# EAGLE design sram (EAGLE 9.6.2)
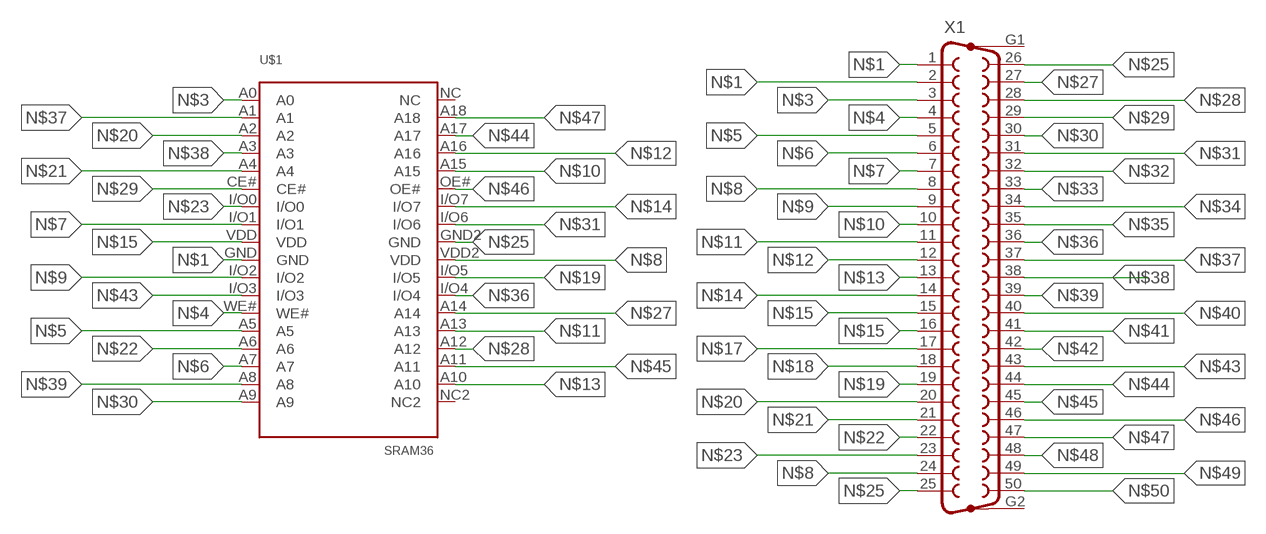
[diagram p0: schematic, sheet 1]

## Parts
U$1  SRAM36  [TF-BGA]
X1  F50VP  [F50VP]

## Nets
N$1: U$1.GND X1.1 X1.2
N$3: U$1.A0 X1.3
N$4: U$1.WE# X1.4
N$5: U$1.A5 X1.5
N$6: U$1.A7 X1.6
N$7: U$1.I/O1 X1.7
N$8: U$1.VDD2(VDD) X1.8 X1.24
N$9: U$1.I/O2 X1.9
N$10: U$1.A15 X1.10
N$11: U$1.A13 X1.11
N$12: U$1.A16 X1.12
N$13: U$1.A10 X1.13
N$14: U$1.I/O7 X1.14
N$15: U$1.VDD X1.15 X1.16
N$17: X1.17
N$18: X1.18
N$19: U$1.I/O5 X1.19
N$20: U$1.A2 X1.20
N$21: U$1.A4 X1.21
N$22: U$1.A6 X1.22
N$23: U$1.I/O0 X1.23
N$25: U$1.GND2(GND) X1.25 X1.26
N$27: U$1.A14 X1.27
N$28: U$1.A12 X1.28
N$29: U$1.CE# X1.29
N$30: U$1.A9 X1.30
N$31: U$1.I/O6 X1.31
N$32: X1.32
N$33: X1.33
N$34: X1.34
N$35: X1.35
N$36: U$1.I/O4 X1.36
N$37: U$1.A1 X1.37
N$38: U$1.A3 X1.38
N$39: U$1.A8 X1.39
N$40: X1.40
N$41: X1.41
N$42: X1.42
N$43: U$1.I/O3 X1.43
N$44: U$1.A17 X1.44
N$45: U$1.A11 X1.45
N$46: U$1.OE# X1.46
N$47: U$1.A18 X1.47
N$48: X1.48
N$49: X1.49
N$50: X1.50
Unconnected: U$1.NC U$1.NC2 X1.G1 X1.G2

## Library data of the parts
U$1 = SRAM:SRAM36
X1 = con-subd:F50VP: SUB-D; OC_FARNELL: unknown; OC_NEWARK: unknown

## Board
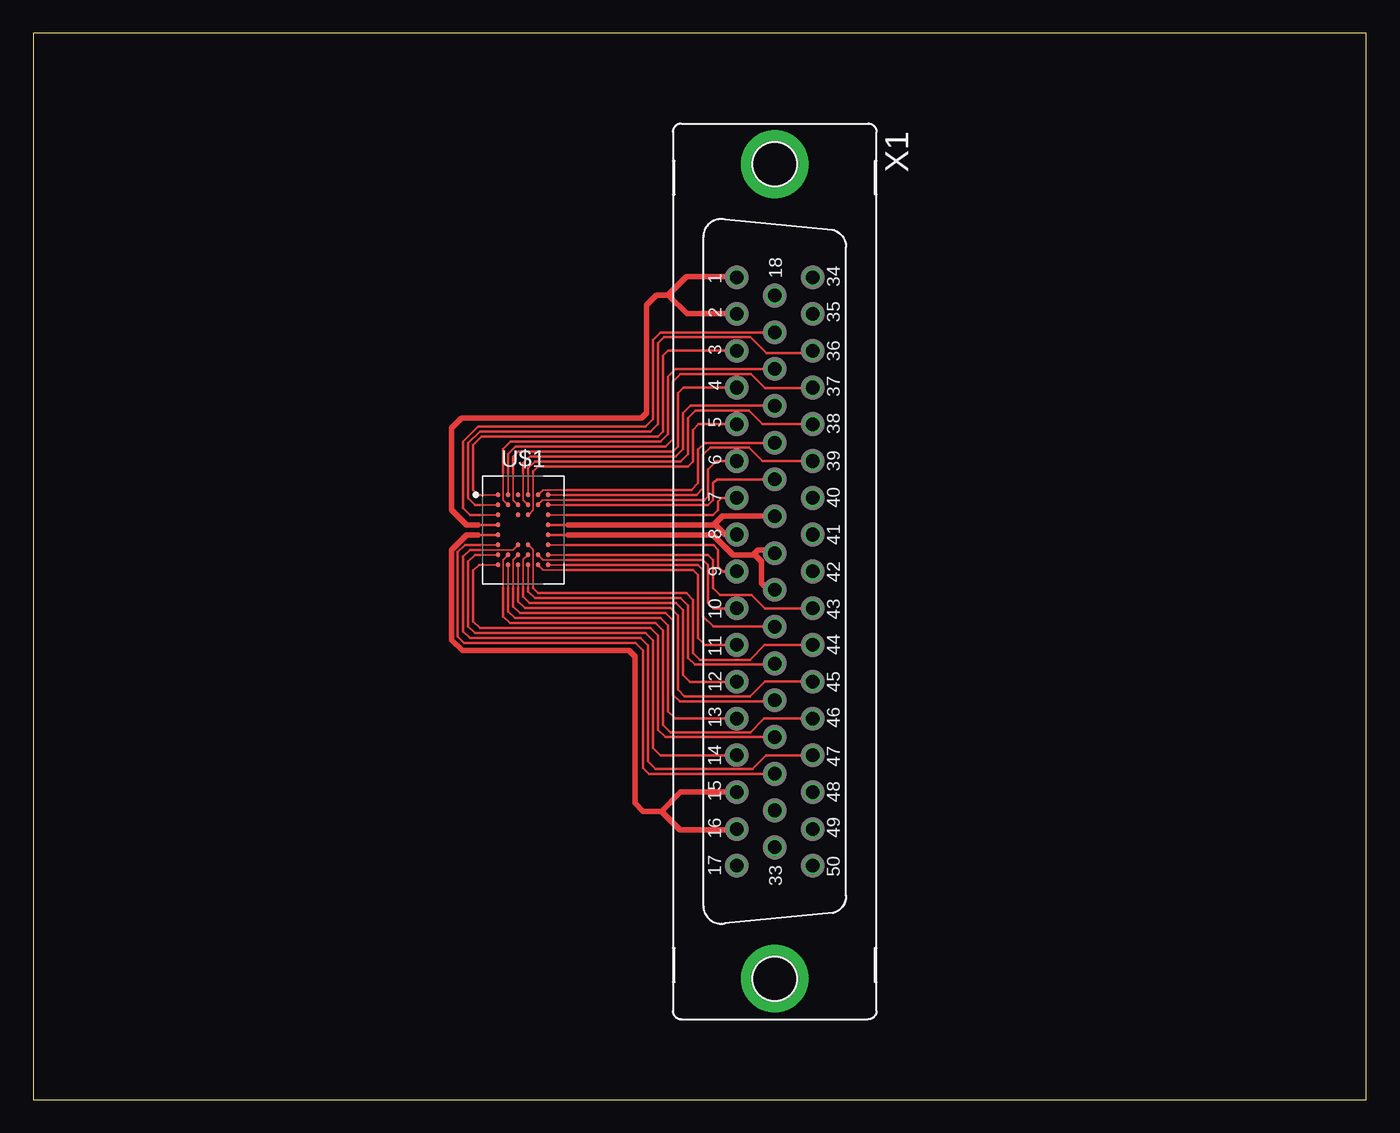
[diagram p1: board, top side]

Size 100 x 80 mm. Coordinates in mm from the lower left corner, seen from the top.
Outline: 0,0 100,0 100,80 0,80 0,0
Copper layers (1*16): Top 0.035mm / dielectric 1.5mm / Bottom 0.035mm
Design rules "default *": minimum track width 0.06mm, minimum drill 0.35mm, track to track 6mil, track to pad 6mil, pad to pad 6mil, via to via 6mil, smd to smd 6mil, copper to edge 40mil, drill to drill 6mil, minimum pad ring 10mil, minimum via ring 8mil, stop-mask expansion 4mil, vias tented up to drill 0mil, thermal gap 10mil

### Footprints (pad centres in the part's own frame; a part is rotated, then mirrored left to right if it is on the bottom)
TF-BGA = smd 0.33 x 0.33: A0 -1.875,2.625; A1 -1.125,2.625; A2 -1.125,1.875; A3 0.375,2.625; A4 0.375,1.875; A5 0.375,1.125; A6 1.125,2.625; A7 1.125,1.875; A8 1.875,2.625; A9 -1.875,-2.625; A10 -1.125,-2.625; A11 -0.375,-2.625; A12 0.375,-2.625; A13 1.125,-2.625; A14 1.875,-2.625; A15 1.125,-1.875; A16 0.375,-1.875; A17 0.375,-1.125; A18 -0.375,-1.125; CE# -0.375,-1.875; GND -1.875,0.375; GND2 1.875,-0.375; I/O0 1.875,1.875; I/O1 1.875,1.125; I/O2 1.875,-1.125; I/O3 1.875,-1.875; I/O4 -1.875,1.875; I/O5 -1.875,1.125; I/O6 -1.875,-1.125; I/O7 -1.875,-1.875; NC -0.375,2.625; NC2 -0.375,1.125; OE# -1.125,-1.875; VDD -1.875,-0.375; VDD2 1.875,0.375; WE# -0.375,1.875
F50VP = drill 1.016 octagon: 1 -22.073,-2.845; 2 -19.329,-2.845; 3 -16.561,-2.845; 4 -13.792,-2.845; 5 -11.049,-2.845; 6 -8.28,-2.845; 7 -5.512,-2.845; 8 -2.769,-2.845; 9 0,-2.845; 10 2.769,-2.845; 11 5.512,-2.845; 12 8.28,-2.845; 13 11.049,-2.845; 14 13.792,-2.845; 15 16.561,-2.845; 16 19.329,-2.845; 17 22.073,-2.845; 18 -20.701,0; 19 -17.932,0; 20 -15.189,0; 21 -12.421,0; 22 -9.652,0; 23 -6.909,0; 24 -4.14,0; 25 -1.372,0; 26 1.372,0; 27 4.14,0; 28 6.909,0; 29 9.652,0; 30 12.421,0; 31 15.189,0; 32 17.932,0; 33 20.701,0; 34 -22.073,2.845; 35 -19.329,2.845; 36 -16.561,2.845; 37 -13.792,2.845; 38 -11.049,2.845; 39 -8.28,2.845; 40 -5.512,2.845; 41 -2.769,2.845; 42 0,2.845; 43 2.769,2.845; 44 5.512,2.845; 45 8.28,2.845; 46 11.049,2.845; 47 13.792,2.845; 48 16.561,2.845; 49 19.329,2.845; 50 22.073,2.845 | drill 3.302 pad 5.08: G1 30.556,0; G2 -30.556,0

### Placement (x,y rotation side)
U$1  36.75,42.75 0 top
X1  55.62,39.62 270 top

### Tracks (layer width: path | path; a pad name or v marks a point on that pad's centre or on a via)
N$1
  Top 0.2: U$1.GND 33.38,43.12
  Top 0.4: 33.38,43.12 32.5,43.12 31.38,44.25 31.38,50.38 32.12,51.12 45.62,51.12 46,51.5 46,59.62 46.75,60.38 47.62,60.38 | X1.2 49.05,58.95 47.62,60.38 | 47.62,60.38 49,61.75 52.73,61.75 X1.1
N$3
  Top 0.1: 33.5,45.38 U$1.A0
  Top 0.2: X1.3 47.62,56.19 47.25,55.81 47.25,50.12 46.88,49.75 33.62,49.75 33,49.12 33,45.75 33.38,45.38 33.5,45.38
N$4
  Top 0.1: U$1.WE# 36,45 36,47
  Top 0.2: 36,47 36,48.25 36.38,48.62 48,48.62 48.38,49 48.38,53 48.79,53.42 X1.4
N$5
  Top 0.1: U$1.A5 37.15,43.88 37.49,44.22 37.49,46.99
  Top 0.2: 37.49,46.99 37.49,47.12 37.88,47.5 49.12,47.5 49.5,47.88 49.5,50.25 49.92,50.67 X1.5
N$6
  Top 0.1: U$1.A7 37.88,44.65 38.22,44.99 39.99,44.99
  Top 0.2: X1.6 51.25,47.91 50.62,47.28 50.62,45.25 50.37,44.99 39.99,44.99
N$7
  Top 0.1: U$1.I/O1 40,43.88
  Top 0.2: 40,43.88 51,43.88 51.38,44.25 51.38,44.88 51.64,45.14 X1.7
N$8
  Top 0.2: U$1.VDD2 40.12,43.12
  Top 0.4: 40.12,43.12 51.05,43.12 51.11,43.19 | X1.8 51.91,42.39 51.11,43.19 | 51.11,43.19 51.69,43.77 X1.24
N$9
  Top 0.1: U$1.I/O2 40,41.62
  Top 0.2: X1.9 51.75,39.62 51.38,40 51.38,41.25 51.06,41.56 51,41.62 40,41.62
N$10
  Top 0.1: U$1.A15 38.25,40.5 40,40.5
  Top 0.2: 40,40.5 50.25,40.5 50.62,40.12 50.62,37.25 51.02,36.86 X1.10
N$11
  Top 0.1: U$1.A13 38.25,39.75 40,39.75
  Top 0.2: X1.11 50.39,34.11 49.88,34.62 49.88,39.38 49.5,39.75 40,39.75
N$12
  Top 0.1: U$1.A16 37.1,40.88 36.76,40.53 36.76,38.45
  Top 0.2: 36.76,38.45 36.76,37.74 37.23,37.27 48.23,37.27 48.75,36.75 48.75,31.88 49.28,31.34 X1.12
N$13
  Top 0.1: U$1.A10 35.62,38.44
  Top 0.2: 35.62,38.44 35.62,36.62 36.12,36.12 47.06,36.12 47.62,35.56 47.62,29.12 48.17,28.58 X1.13
N$14
  Top 0.1: U$1.I/O7 33.5,40.88
  Top 0.2: 33.5,40.88 33.12,40.88 32.62,40.38 32.62,35.5 33.12,35 45.94,35 46.5,34.44 46.5,26.38 47.04,25.83 X1.14
N$15
  Top 0.2: U$1.VDD 33.38,42.38
  Top 0.4: 33.38,42.38 32.5,42.38 31.38,41.25 31.38,34.5 32.19,33.69 44.69,33.69 45.12,33.25 45.12,22.25 45.75,21.62 47.12,21.62 | X1.15 48.56,23.06 47.12,21.62 | 47.12,21.62 48.5,20.25 52.73,20.25 X1.16
N$19
  Top 0.1: U$1.I/O5 33.5,43.88
  Top 0.2: X1.19 47.06,57.56 46.5,57 46.5,51.06 45.94,50.5 33.38,50.5 32.25,49.38 32.25,44.38 32.75,43.88 33.5,43.88
N$20
  Top 0.1: 35.25,47 35.25,45 U$1.A2
  Top 0.2: 35.25,47 35.25,48.81 35.81,49.38 47.06,49.38 47.62,49.94 47.62,54.25 48.19,54.81 X1.20
N$21
  Top 0.1: 36.75,47 36.75,45 U$1.A4
  Top 0.2: 36.75,47 36.75,47.75 37.25,48.25 48.19,48.25 48.75,48.81 48.75,51.5 49.31,52.06 55.61,52.06 X1.21
N$22
  Top 0.1: 40,45.75 38.25,45.75 U$1.A6
  Top 0.2: 40,45.75 49.38,45.75 49.88,46.25 49.88,48.75 50.4,49.27 X1.22
N$23
  Top 0.1: U$1.I/O0 40,44.62
  Top 0.2: 40,44.62 50.62,44.62 51,45 51,46.25 51.28,46.53 X1.23
N$25
  Top 0.2: U$1.GND2 40.12,42.38
  Top 0.4: 40.12,42.38 51,42.38 52.5,40.87 54,40.87 | 54,40.87 54.12,40.87 54.63,40.37 54.63,38.75 55.12,38.25 X1.26 | X1.25 55.38,41.25 54.38,41.25 54,40.87
N$27
  Top 0.1: U$1.A14 40,40.12
  Top 0.2: X1.27 51.02,35.48 50.25,36.25 50.25,39.75 49.88,40.12 40,40.12
N$28
  Top 0.1: U$1.A12 37.12,38.44
  Top 0.2: 37.12,38.44 37.12,38.12 37.62,37.62 48.56,37.62 49.12,37.06 49.12,33.15 49.62,32.65 55.56,32.65 X1.28
N$29
  Top 0.1: 36,38.44 36,40.5 U$1.CE#
  Top 0.2: 36,38.44 36,37 36.5,36.5 47.44,36.5 48,35.94 48,30.38 48.5,29.88 55.53,29.88 X1.29
N$30
  Top 0.1: 33.5,40.12 U$1.A9
  Top 0.2: 33.5,40.12 33.44,40.12 33,39.69 33,35.88 33.5,35.38 46.31,35.38 46.88,34.81 46.88,27.75 47.42,27.2 X1.30
N$31
  Top 0.1: U$1.I/O6 33.5,41.62
  Top 0.2: 33.5,41.62 32.39,41.62 31.83,41.06 31.83,34.75 32.33,34.25 45.19,34.25 45.75,33.69 45.75,24.88 46.19,24.44 X1.31
N$36
  Top 0.1: U$1.I/O4 33.5,44.62
  Top 0.2: X1.36 58.28,56 55,56 53.8,57.2 47.33,57.2 46.88,56.75 46.88,50.69 46.31,50.12 33.5,50.12 32.62,49.25 32.62,45.12 33.12,44.62 33.5,44.62
N$37
  Top 0.1: U$1.A1 35.62,47
  Top 0.2: 35.62,47 35.62,48.44 36.19,49 47.44,49 48,49.56 48,53.88 48.56,54.43 53.83,54.43 54.88,53.38 58.43,53.38 X1.37
N$38
  Top 0.1: U$1.A3 37.12,47
  Top 0.2: 37.12,47 37.12,47.37 37.63,47.88 48.56,47.88 49.13,48.44 49.13,51.13 49.69,51.69 53.7,51.69 54.72,50.67 X1.38
N$39
  Top 0.1: U$1.A8 40,45.38
  Top 0.2: 40,45.38 49.75,45.38 50.25,45.87 50.25,48.38 50.8,48.92 53.7,48.92 54.72,47.91 X1.39
N$43
  Top 0.1: U$1.I/O3 40,40.88
  Top 0.2: 40,40.88 50.62,40.88 51,40.5 51,38.38 51.5,37.88 53.88,37.88 54.89,36.86 X1.43
N$44
  Top 0.1: U$1.A17 37.15,41.62 37.49,41.28 37.49,38.45
  Top 0.2: 37.49,38.45 37.49,38.38 37.88,38 49,38 49.5,37.5 49.5,33.5 50,33 53.75,33 54.86,34.11 X1.44
N$45
  Top 0.1: U$1.A11 36.38,38.44
  Top 0.2: X1.45 58.44,31.38 54.88,31.38 53.76,30.26 48.87,30.26 48.38,30.75 48.38,36.31 47.81,36.88 36.88,36.88 36.38,37.38 36.38,38.44
N$46
  Top 0.1: U$1.OE# 35.25,40.5 35.25,38.44
  Top 0.2: 35.25,38.44 35.25,36.25 35.75,35.75 46.69,35.75 47.25,35.19 47.25,28.12 47.81,27.56 53.81,27.56 54.83,28.58 X1.46
N$47
  Top 0.1: U$1.A18 36,41.25 33.5,41.25
  Top 0.2: X1.47 54.95,25.82 53.95,24.82 46.68,24.82 46.12,25.38 46.12,34.06 45.56,34.62 32.75,34.62 32.25,35.12 32.25,40.75 32.75,41.25 33.5,41.25